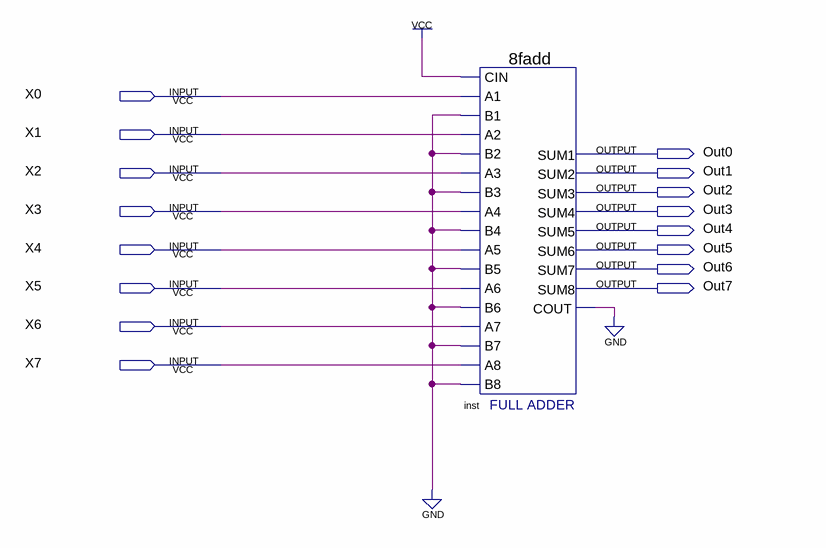
[diagram p0: schematic sheet]
// Quartus schematic Increameter.bdf as structural Verilog: 1 symbols, 16 pins
module Increameter (
  input  X0,
  input  X1,
  input  X2,
  input  X3,
  input  X4,
  input  X5,
  input  X6,
  input  X7,
  output Out0,
  output Out1,
  output Out2,
  output Out3,
  output Out4,
  output Out5,
  output Out6,
  output Out7
);

  wire inst_cout;

  \8fadd  inst (
    .A1(X0), .A3(X2), .CIN(1'b1), .B1(1'b0), .A2(X1), .B2(1'b0), .A4(X3), .B4(1'b0), .A5(X4), .A7(X6),
    .B6(1'b0), .B3(1'b0), .B8(1'b0), .B5(1'b0), .A6(X5), .B7(1'b0), .A8(X7), .SUM2(Out1), .SUM5(Out4),
    .SUM6(Out5), .SUM1(Out0), .COUT(inst_cout), .SUM3(Out2), .SUM4(Out3), .SUM7(Out6), .SUM8(Out7));
  // also tied to GND on the sheet: inst_cout
endmodule
